# EAGLE design board-esp-32 (EAGLE 9.6.2)
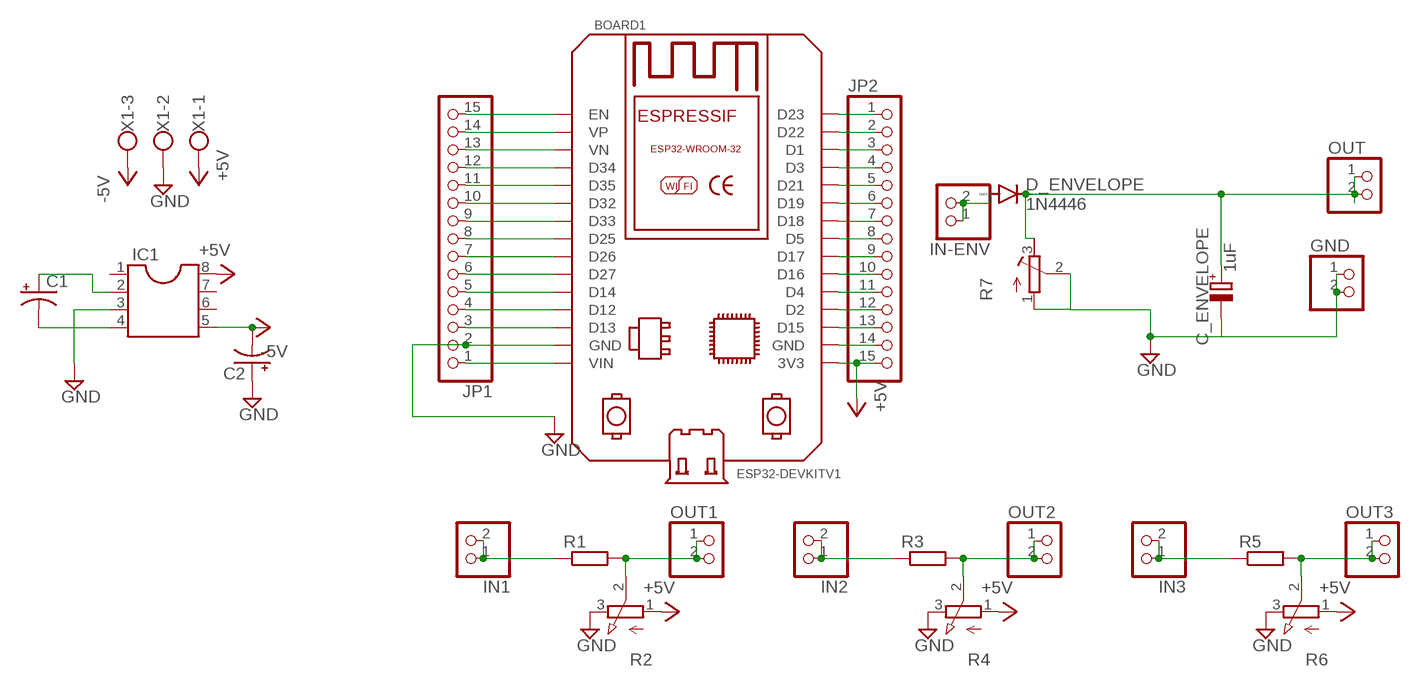
[diagram p0: schematic, sheet 1]

## Parts
BOARD1  ESP32DEVKITV1  [ESP32-DEVKITV1]
C1  CPOL-USE2.5-5  [E2,5-5]
C2  CPOL-USE2.5-5  [E2,5-5]
C_ENVELOPE  1uF  CPOL-EUE2.5-6  [E2,5-6]
D_ENVELOPE  1N4446  [DO35-10]
GND  PINHD-1X2  [1X02]
IC1  DIL8S  [SOCKET-08]
IN1  PINHD-1X2  [1X02]
IN2  PINHD-1X2  [1X02]
IN3  PINHD-1X2  [1X02]
IN-ENV  PINHD-1X2  [1X02]
JP1  PINHD-1X15  [1X15]
JP2  PINHD-1X15  [1X15]
OUT  PINHD-1X2  [1X02]
OUT1  PINHD-1X2  [1X02]
OUT2  PINHD-1X2  [1X02]
OUT3  PINHD-1X2  [1X02]
R1  R-EU_0207/10  [0207/10]
R2  3RP/1610N  [3RP/1610N]
R3  R-EU_0207/10  [0207/10]
R4  3RP/1610N  [3RP/1610N]
R5  R-EU_0207/10  [0207/10]
R6  3RP/1610N  [3RP/1610N]
R7  R-TRIMM3339P  [RTRIM3339P]
X1  W237-103  [W237-103]

## Nets
+5V: BOARD1.3V3 IC1.8 JP2.15 R2.1(A) R4.1(A) R6.1(A) X1.1
-5V: C2.- IC1.5 X1.3
GND: BOARD1.GND C2.+ C_ENVELOPE.- GND.1 GND.2 IC1.3 JP1.2 R2.3(E) R4.3(E) R6.3(E) R7.1(A) R7.2(S) X1.2
N$1: IN1.1 IN1.2 R1.1
N$2: OUT1.1 OUT1.2 R1.2 R2.2(S)
N$3: IN2.1 IN2.2 R3.1
N$4: OUT2.1 OUT2.2 R3.2 R4.2(S)
N$5: IN3.1 IN3.2 R5.1
N$6: OUT3.1 OUT3.2 R5.2 R6.2(S)
N$8: BOARD1.GND@1(GND) JP2.14
N$9: C1.+ IC1.2
N$10: C1.- IC1.4
N$12: BOARD1.D15 JP2.13
N$13: BOARD1.D2 JP2.12
N$14: BOARD1.D4 JP2.11
N$15: BOARD1.D16 JP2.10
N$16: BOARD1.D17 JP2.9
N$17: BOARD1.D5 JP2.8
N$21: C_ENVELOPE.+ D_ENVELOPE.C OUT.1 OUT.2 R7.3(E)
N$22: D_ENVELOPE.A IN-ENV.1 IN-ENV.2
N$23: BOARD1.D18 JP2.7
N$24: BOARD1.D19 JP2.6
N$25: BOARD1.D21 JP2.5
N$26: BOARD1.D3 JP2.4
N$27: BOARD1.D1 JP2.3
N$28: BOARD1.D22 JP2.2
N$29: BOARD1.D23 JP2.1
N$30: BOARD1.EN JP1.15
N$31: BOARD1.VP JP1.14
N$32: BOARD1.VN JP1.13
N$33: BOARD1.D34 JP1.12
N$34: BOARD1.D35 JP1.11
N$35: BOARD1.D32 JP1.10
N$36: BOARD1.D33 JP1.9
N$37: BOARD1.D25 JP1.8
N$38: BOARD1.D26 JP1.7
N$39: BOARD1.D27 JP1.6
N$40: BOARD1.D14 JP1.5
N$41: BOARD1.D12 JP1.4
N$42: BOARD1.D13 JP1.3
N$44: BOARD1.VIN JP1.1
Unconnected: IC1.1 IC1.6 IC1.7

## Library data of the parts
BOARD1 = ESP32-DEVKITV1:ESP32DEVKITV1: https://github.com/shridattdudhat
C1 C2 = rcl:CPOL-US: POLARIZED CAPACITOR, American symbol; SPICEPREFIX: C
C_ENVELOPE = rcl:CPOL-EU: POLARIZED CAPACITOR, European symbol; SPICEPREFIX: C
D_ENVELOPE = diode:1N4446: DIODE high speed (Philips)
GND IN1-IN3 IN-ENV OUT OUT1-OUT3 = pinhead:PINHD-1X2: PIN HEADER
IC1 = ic-package:DIL8: Dual In Line / Socket
JP1 JP2 = pinhead:PINHD-1X15: PIN HEADER
R1 R3 R5 = rcl:R-EU_: RESISTOR, European symbol; SPICEPREFIX: R
R2 R4 R6 = pot:3RP/1610N: 16mm Potentiometer one level Source: http://www.alphapotentiometers.net/html/16mm_pot_2.html
R7 = rcl:R-TRIMM: Trimm resistor; SPICEMODEL: X; SPICEPREFIXL: POT
X1 = con-wago-500:W237-103: WAGO SCREW CLAMP; MPN: 237-103; OC_FARNELL: unknown; OC_NEWARK: 18M7116

## Board
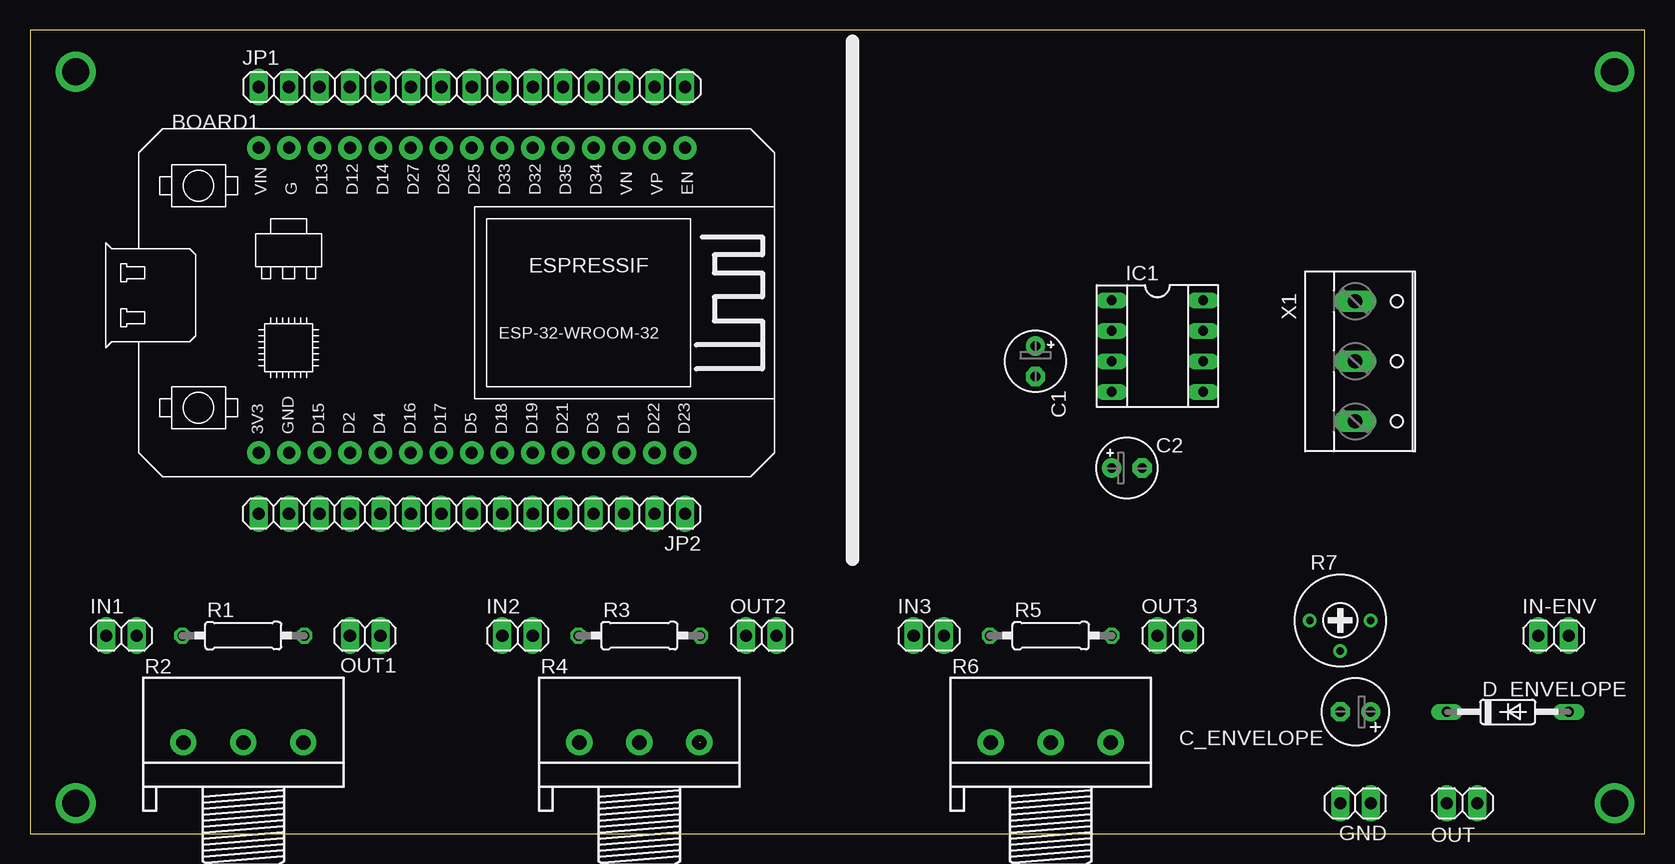
[diagram p1: board, top side]
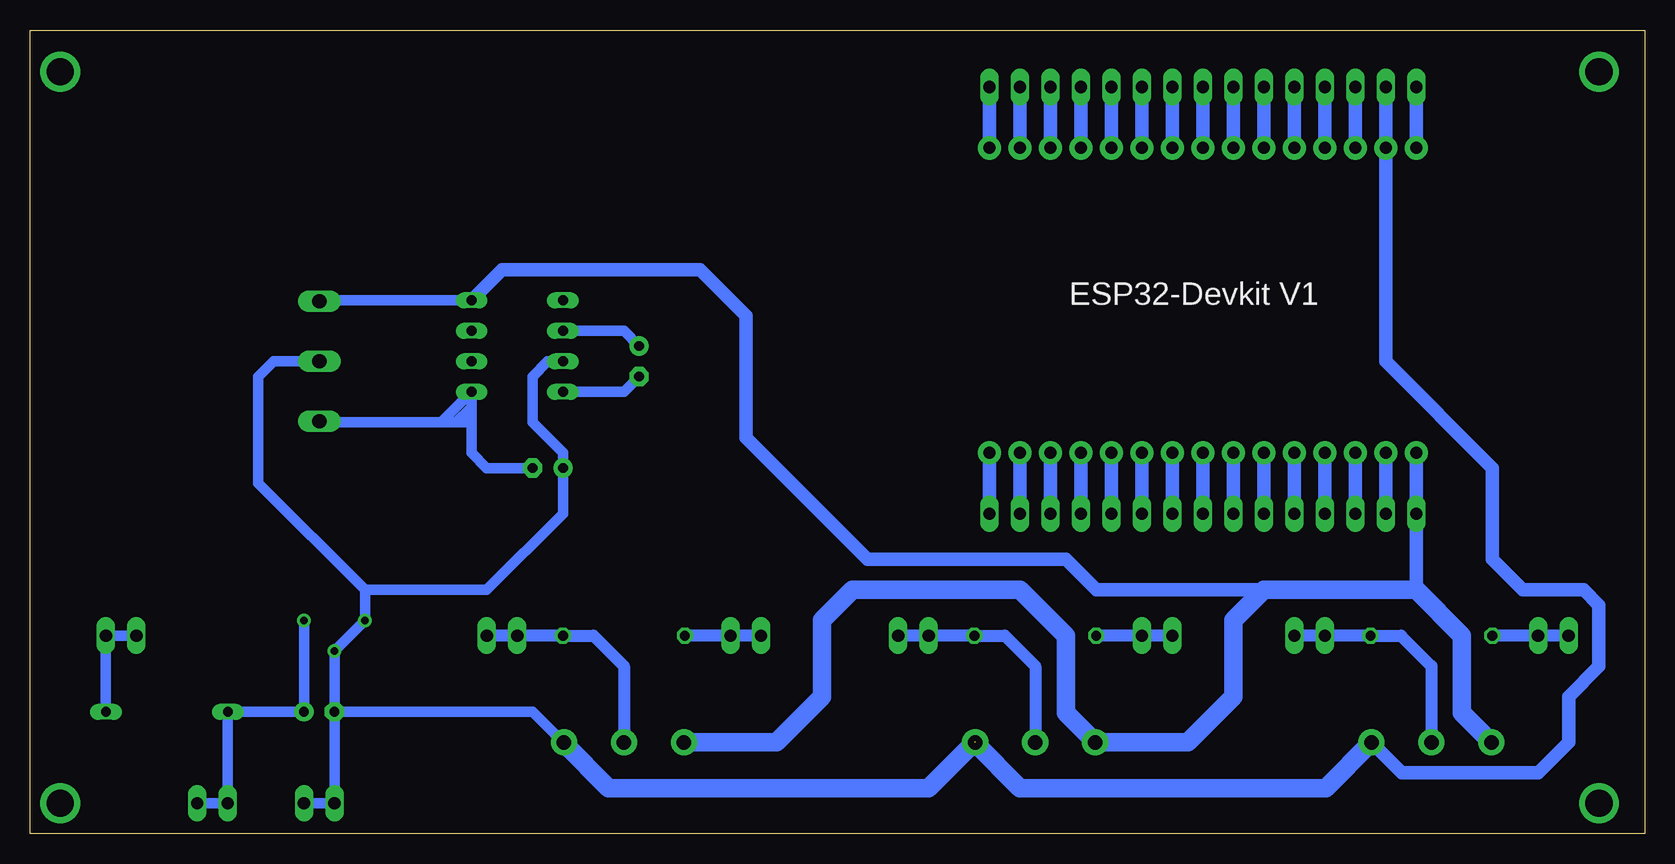
[diagram p2: board, bottom side, seen from below]

Size 134.6 x 66.98 mm. Coordinates in mm from the lower left corner, seen from the top.
Outline: 0,0 134.6,0 134.6,66.98 0,66.98 0,0
Copper layers (1*16): Top 0.035mm / dielectric 1.5mm / Bottom 0.035mm
Design rules "default": minimum track width 6mil, minimum drill 0.35mm, track to track 6mil, track to pad 6mil, pad to pad 6mil, via to via 6mil, smd to smd 6mil, copper to edge 40mil, drill to drill 6mil, minimum pad ring 10mil, minimum via ring 8mil, stop-mask expansion 4mil, vias tented up to drill 0mil, thermal gap 10mil

### Footprints (pad centres in the part's own frame; a part is rotated, then mirrored left to right if it is on the bottom)
ESP32-DEVKITV1 = drill 1 pad 1.93: 3V3 0,0; D1 30.48,0; D2 7.62,0; D3 27.94,0; D4 10.16,0; D5 17.78,0; D12 7.62,25.4; D13 5.08,25.4; D14 10.16,25.4; D15 5.08,0; D16 12.7,0; D17 15.24,0; D18 20.32,0; D19 22.86,0; D21 25.4,0; D22 33.02,0; D23 35.56,0; D25 17.78,25.4; D26 15.24,25.4; D27 12.7,25.4; D32 22.86,25.4; D33 20.32,25.4; D34 27.94,25.4; D35 25.4,25.4; EN 35.56,25.4; GND 2.54,25.4; GND@1 2.54,0; VIN 0,25.4; VN 30.48,25.4; VP 33.02,25.4
E2,5-5 = drill 0.813 pad 1.6: + -1.27,0 | drill 0.813 pad 1.6 octagon: - 1.27,0
E2,5-6 = drill 0.813 pad 1.6: + -1.27,0 | drill 0.813 pad 1.6 octagon: - 1.27,0
DO35-10 = drill 0.813 long: A 5.08,0; C -5.08,0
1X02 = drill 1.016 long: 1 -1.27,0; 2 1.27,0
SOCKET-08 = drill 0.813 long: 1 -3.81,-3.81; 2 -1.27,-3.81; 3 1.27,-3.81; 4 3.81,-3.81; 5 3.81,3.81; 6 1.27,3.81; 7 -1.27,3.81; 8 -3.81,3.81
1X15 = drill 1.016 long: 1 -17.78,0; 2 -15.24,0; 3 -12.7,0; 4 -10.16,0; 5 -7.62,0; 6 -5.08,0; 7 -2.54,0; 8 0,0; 9 2.54,0; 10 5.08,0; 11 7.62,0; 12 10.16,0; 13 12.7,0; 14 15.24,0; 15 17.78,0
0207/10 = drill 0.813 octagon: 1 -5.08,0; 2 5.08,0
3RP/1610N = drill 1.2 pad 2.184: 1 -5,0; 2 0,0; 3 5,0
RTRIM3339P = drill 0.61: 1 -2.54,0; 2 0,-2.54; 3 2.54,0
W237-103 = drill 1.194 long: 1 -5,-1.29; 2 0,-1.29; 3 5,-1.29

### Placement (x,y rotation side)
BOARD1  19.05,31.75 0 top
C1  83.82,39.37 270 top
C2  91.44,30.48 0 top
C_ENVELOPE  110.49,10.16 180 top
D_ENVELOPE  123.19,10.16 0 top
GND  110.49,2.54 180 top
IC1  93.98,40.64 270 top
IN1  7.62,16.51 0 top
IN2  40.64,16.51 0 top
IN3  74.93,16.51 0 top
IN-ENV  127,16.51 0 top
JP1  36.83,62.23 0 top
JP2  36.83,26.67 180 top
OUT  119.38,2.54 0 top
OUT1  27.94,16.51 180 top
OUT2  60.96,16.51 0 top
OUT3  95.25,16.51 0 top
R1  17.78,16.51 0 top
R2  17.78,7.62 0 top
R3  50.8,16.51 0 top
R4  50.8,7.62 0 top
R5  85.09,16.51 0 top
R6  85.09,7.62 0 top
R7  109.22,17.78 0 top
X1  111.76,39.37 270 top

### Tracks (layer width: path | path; a pad name or v marks a point on that pad's centre or on a via)
+5V
  Bottom 0.889: IC1.8 110.39,44.45 X1.1
  Bottom 1.143: 31.75,20.32 45.72,20.32 48.26,22.86 64.77,22.86 74.93,33.02 74.93,43.18 78.74,46.99 95.25,46.99 IC1.8 | BOARD1.3V3 JP2.15 19.05,20.32
  Bottom 1.524: R2.1 15.24,10.08 15.24,16.51 19.05,20.32 31.75,20.32 34.29,17.78 34.29,11.43 38.1,7.62 R4.1 48.26,10.08 48.26,16.51 52.07,20.32 66.04,20.32 68.58,17.78 68.58,11.43 72.39,7.62 R6.1
-5V
  Bottom 0.889: 97.79,34.29 97.79,31.75 96.52,30.48 C2.- | 97.79,34.29 97.79,35.56 | 97.79,35.56 IC1.5 100.33,34.29 | 97.79,34.29 99.06,34.29 | 100.33,34.29 110.39,34.29 X1.3 | 100.33,34.29 99.06,34.29 | 99.06,34.29 97.79,35.56
GND  (1 unrouted)
  Bottom 0.889: IC1.3 91.44,39.37 92.71,38.1 92.71,34.29 90.17,31.75 C2.+ 90.17,26.67 96.52,20.32 106.68,20.32 | X1.2 114.3,39.37 115.57,38.1 115.57,29.21 106.68,20.32 | 106.68,20.32 R7.1 R7.2 C_ENVELOPE.- | 90.09,7.54 92.71,10.16 C_ENVELOPE.- | C_ENVELOPE.- GND.2 GND.1
  Bottom 1.143: JP1.2 BOARD1.GND 21.59,39.37 12.7,30.48 12.7,22.86 10.16,20.32 5.08,20.32 3.81,19.05 3.81,13.97 6.35,11.43 6.35,7.62 8.89,5.08 20.24,5.08 R2.3
  Bottom 1.524: R6.3 90.09,7.54 86.36,3.81 59.69,3.81 55.88,7.62 | 55.8,7.24 R4.3 55.8,7.54 52.07,3.81 26.59,3.81 R2.3
N$1
  Bottom 1.016: IN1.1 IN1.2 R1.1
N$2
  Bottom 1.016: OUT1.1 OUT1.2 R1.2 20.32,16.51 17.78,13.97 R2.2
N$3
  Bottom 1.016: IN2.1 IN2.2 R3.1
N$4
  Bottom 1.016: OUT2.2 OUT2.1 R3.2 53.34,16.51 50.8,13.97 R4.2
N$5
  Bottom 1.016: IN3.1 IN3.2 R5.1
N$6
  Bottom 1.016: OUT3.2 OUT3.1 R5.2 87.63,16.51 85.09,13.97 R6.2
N$8
  Bottom 1.143: JP2.14 BOARD1.GND@1
N$9
  Bottom 0.889: C1.+ 85.09,41.91 IC1.2
N$10
  Bottom 0.889: C1.- 85.09,36.83 IC1.4
N$11  (via drill 2.29)
  other vias: 3.81,63.5
N$12
  Bottom 1.143: JP2.13 BOARD1.D15
N$13
  Bottom 1.143: JP2.12 BOARD1.D2
N$14
  Bottom 1.143: JP2.11 BOARD1.D4
N$15
  Bottom 1.143: JP2.10 BOARD1.D16
N$16
  Bottom 1.143: JP2.9 BOARD1.D17
N$17
  Bottom 1.143: JP2.8 BOARD1.D5
N$18  (via drill 2.29)
  other vias: 3.81,2.54
N$19  (via drill 2.29)
  other vias: 132.08,63.5
N$20  (via drill 2.29)
  other vias: 132.08,2.54
N$21
  Bottom 0.889: R7.3 C_ENVELOPE.+ D_ENVELOPE.C OUT.1 OUT.2
N$22
  Bottom 0.889: D_ENVELOPE.A IN-ENV.2 IN-ENV.1
N$23
  Bottom 1.143: JP2.7 BOARD1.D18
N$24
  Bottom 1.143: JP2.6 BOARD1.D19
N$25
  Bottom 1.143: JP2.5 BOARD1.D21
N$26
  Bottom 1.143: JP2.4 BOARD1.D3
N$27
  Bottom 1.143: JP2.3 BOARD1.D1
N$28
  Bottom 1.143: JP2.2 BOARD1.D22
N$29
  Bottom 1.143: JP2.1 BOARD1.D23
N$30
  Bottom 1.143: BOARD1.EN JP1.15
N$31
  Bottom 1.143: BOARD1.VP JP1.14
N$32
  Bottom 1.143: BOARD1.VN JP1.13
N$33
  Bottom 1.143: BOARD1.D34 JP1.12
N$34
  Bottom 1.143: BOARD1.D35 JP1.11
N$35
  Bottom 1.143: BOARD1.D32 JP1.10
N$36
  Bottom 1.143: BOARD1.D33 JP1.9
N$37
  Bottom 1.143: BOARD1.D25 JP1.8
N$38
  Bottom 1.143: BOARD1.D26 JP1.7
N$39
  Bottom 1.143: BOARD1.D27 JP1.6
N$40
  Bottom 1.143: BOARD1.D14 JP1.5
N$41
  Bottom 1.143: BOARD1.D12 JP1.4
N$42
  Bottom 1.143: BOARD1.D13 JP1.3
N$44
  Bottom 1.143: BOARD1.VIN JP1.1

### Text on the board
tValues: +5V | GND | -5V | ARDUINO-NANO | ICL7660 | ADDER-1 | ADDER-2 | ADDER-3 | IN | IN | OUT | IN | OUT | IN | OUT | ENVELOP | GND | OUT